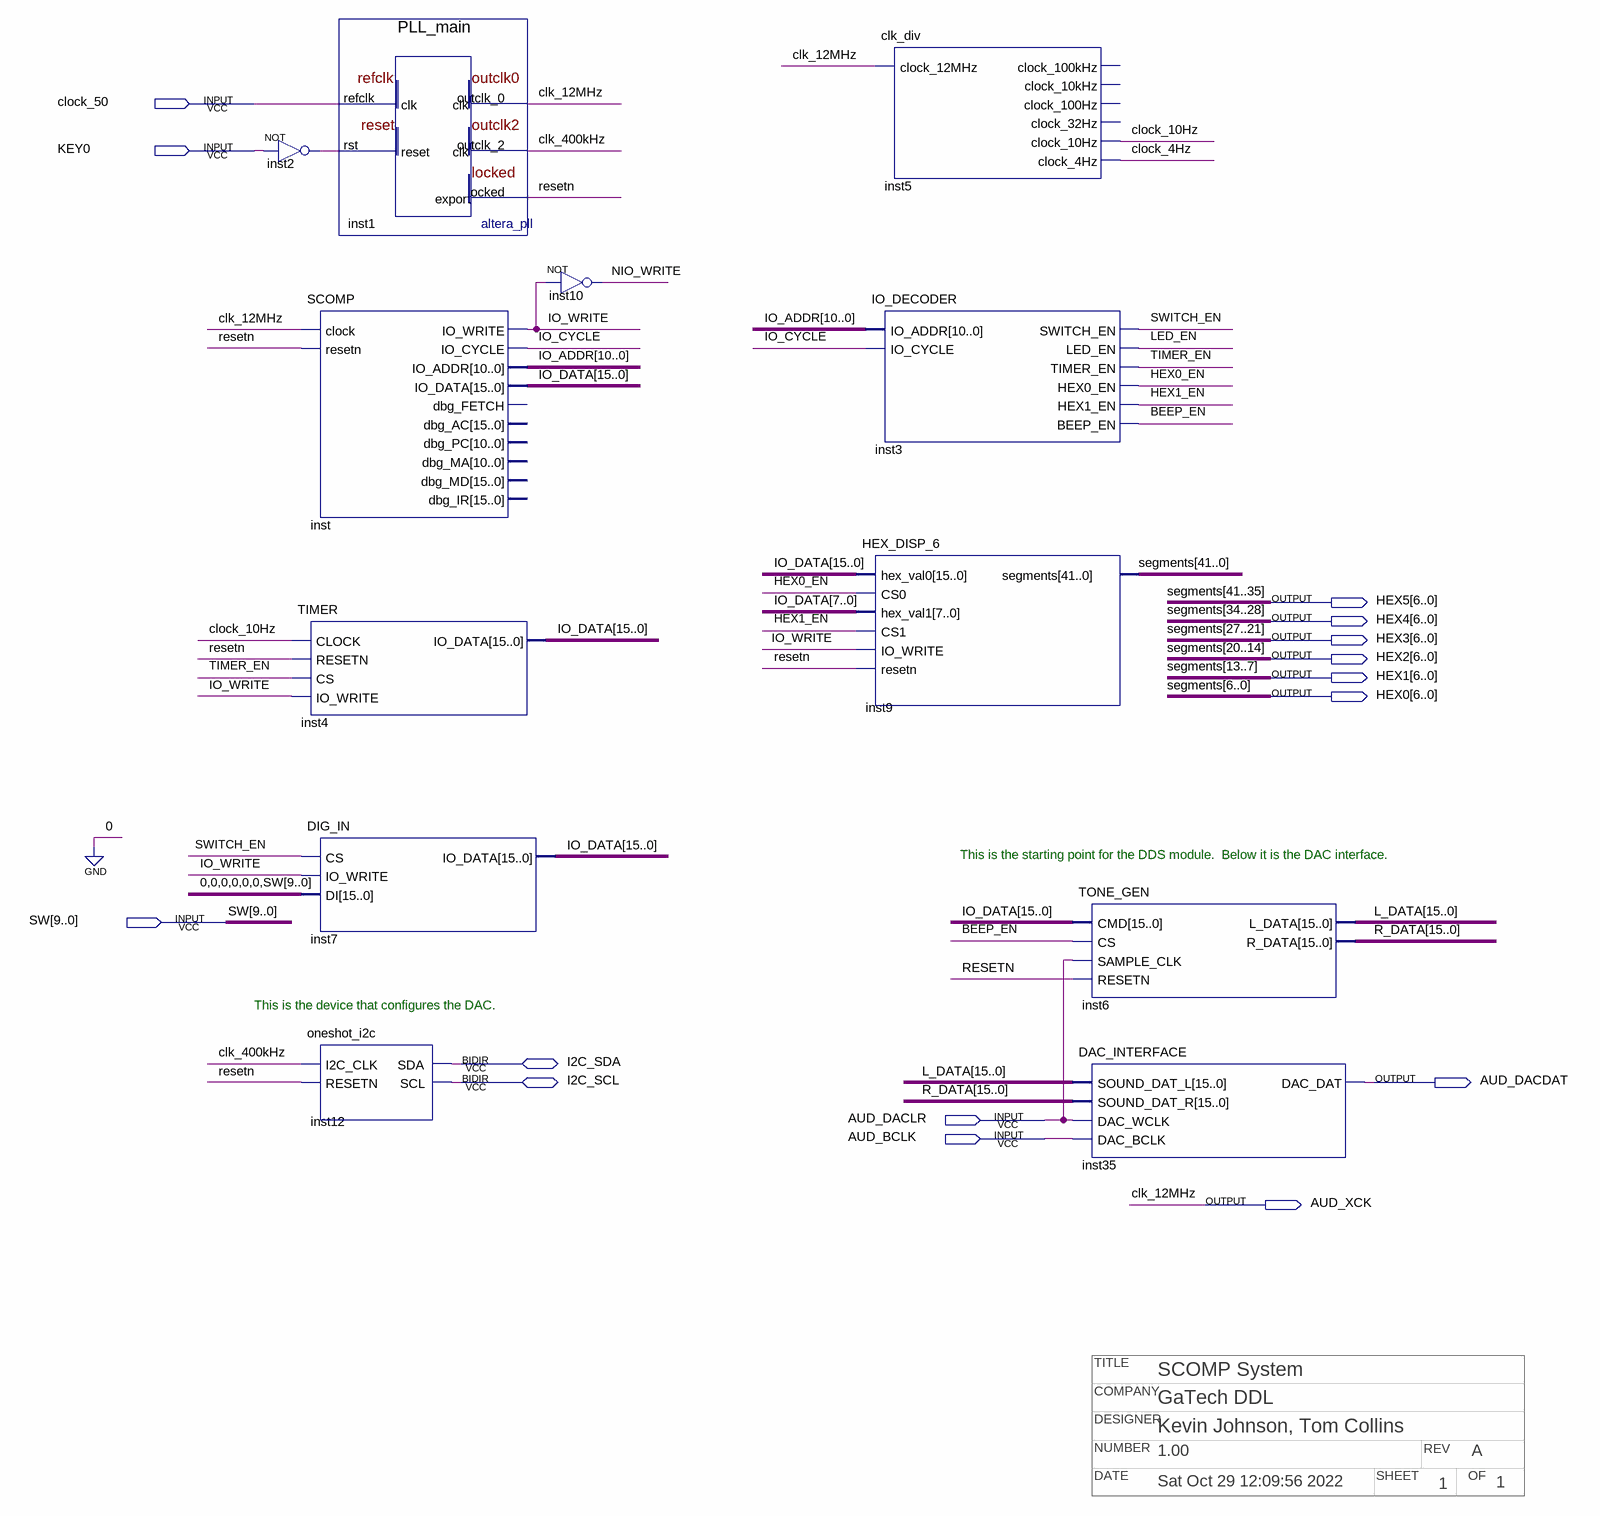
[diagram p0: schematic sheet]
// Quartus schematic SCOMP_System.bdf as structural Verilog: 12 symbols, 15 pins
// Title block: TITLE: SCOMP System; COMPANY: GaTech DDL; DESIGNER: Kevin Johnson, Tom Collins; NUMBER: 1.00; REV: A; DATE: Sat Oct 29 12:09:56 2022; SHEET: 1; OF: 1
module SCOMP_System (
  input  clock_50,
  input  KEY0,
  input  [9:0] SW,
  input  AUD_DACLR,
  input  AUD_BCLK,
  inout  I2C_SDA,
  inout  I2C_SCL,
  output [6:0] HEX5,
  output [6:0] HEX4,
  output [6:0] HEX3,
  output [6:0] HEX2,
  output [6:0] HEX1,
  output [6:0] HEX0,
  output AUD_DACDAT,
  output AUD_XCK
);

  wire BEEP_EN, clk_400kHz, clock_4Hz, clock_10Hz, HEX0_EN, HEX1_EN, inst2_out, IO_CYCLE, IO_WRITE, LED_EN,
       NIO_WRITE, resetn, SWITCH_EN, TIMER_EN;
  wire [10:0] IO_ADDR;
  wire [15:0] IO_DATA, L_DATA, R_DATA;

  not inst2 (inst2_out, KEY0);
  SCOMP inst (
    .clock(AUD_XCK), .resetn(resetn), .IO_WRITE(IO_WRITE), .IO_CYCLE(IO_CYCLE), .IO_ADDR(IO_ADDR),
    .IO_DATA(IO_DATA));  // open: dbg_FETCH, dbg_AC, dbg_PC, dbg_MA, dbg_MD, dbg_IR
  TIMER inst4 (.CLOCK(clock_10Hz), .RESETN(resetn), .CS(TIMER_EN), .IO_WRITE(IO_WRITE), .IO_DATA(IO_DATA));
  DIG_IN inst7 (.CS(SWITCH_EN), .IO_WRITE(IO_WRITE), .DI({{6{1'b0}}, SW}), .IO_DATA(IO_DATA));
  oneshot_i2c inst12 (.I2C_CLK(clk_400kHz), .RESETN(resetn), .SDA(I2C_SDA), .SCL(I2C_SCL));
  PLL_main inst1 (.refclk(clock_50), .rst(inst2_out), .outclk_0(AUD_XCK), .outclk_2(clk_400kHz), .locked(resetn));
  not inst10 (NIO_WRITE, IO_WRITE);
  clk_div inst5 (
    .clock_12MHz(AUD_XCK), .clock_10Hz(clock_10Hz), .clock_4Hz(clock_4Hz));  // open: clock_100kHz, clock_10kHz, clock_100Hz, clock_32Hz
  IO_DECODER inst3 (
    .IO_ADDR(IO_ADDR), .IO_CYCLE(IO_CYCLE), .SWITCH_EN(SWITCH_EN), .LED_EN(LED_EN), .TIMER_EN(TIMER_EN),
    .HEX0_EN(HEX0_EN), .HEX1_EN(HEX1_EN), .BEEP_EN(BEEP_EN));
  HEX_DISP_6 inst9 (
    .hex_val0(IO_DATA), .CS0(HEX0_EN), .hex_val1(IO_DATA[7:0]), .CS1(HEX1_EN), .IO_WRITE(IO_WRITE),
    .resetn(resetn), .segments({HEX5, HEX4, HEX3, HEX2, HEX1, HEX0}));
  TONE_GEN inst6 (
    .CMD(IO_DATA), .CS(BEEP_EN), .SAMPLE_CLK(AUD_DACLR), .RESETN(resetn), .L_DATA(L_DATA), .R_DATA(R_DATA));
  DAC_INTERFACE inst35 (
    .SOUND_DAT_L(L_DATA), .SOUND_DAT_R(R_DATA), .DAC_WCLK(AUD_DACLR), .DAC_BCLK(AUD_BCLK),
    .DAC_DAT(AUD_DACDAT));

  // Other names for the same wires on the sheet: clk_12MHz = AUD_XCK;
  //   segments[41:0] = {HEX5, HEX4, HEX3, HEX2, HEX1, HEX0}

  // Notes on the sheet:
  //   This is the starting point for the DDS module.  Below it is the DAC interface.
  //   This is the device that configures the DAC.
endmodule
